# Altium schematic sheet preamp_gain_stage_2.SchDoc
size A4
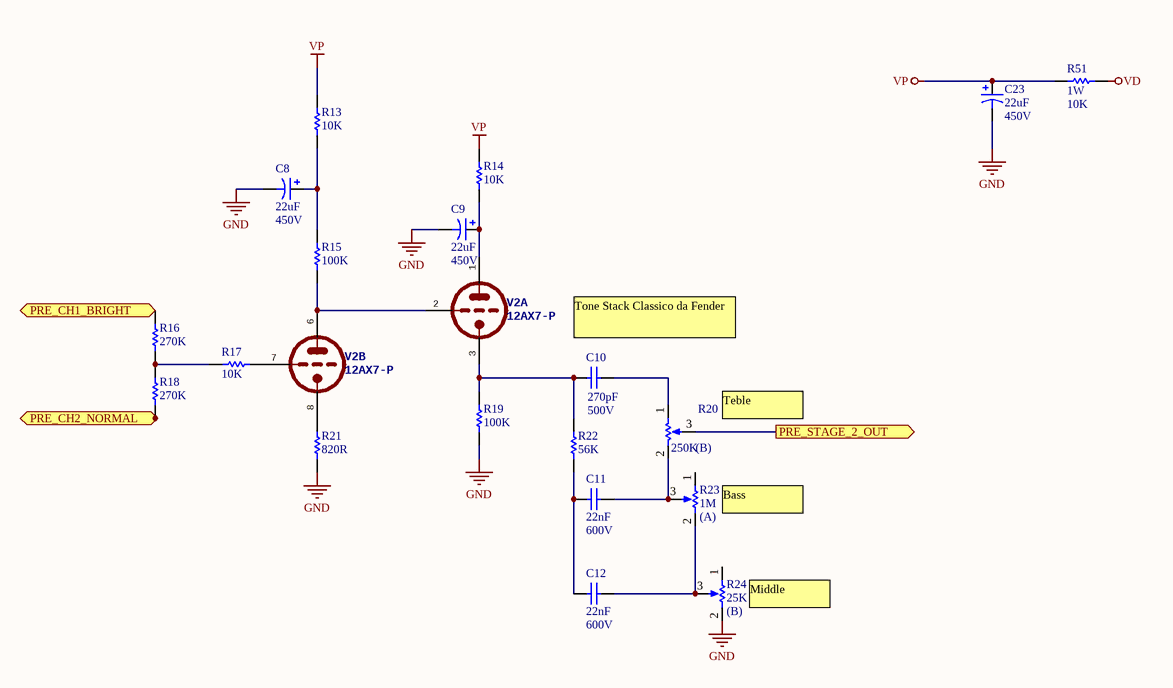
[diagram p0: preamp_gain_stage_2.SchDoc]

## Parts
C8  value 22uF  Voltage: 450V  [RAD-POL-7.6-15]  (hidden comment: Cap Pol Rad)
C9  value 22uF  Voltage: 450V  [RAD-POL-7.6-15]  (hidden comment: Cap Pol Rad)
C10  value 270pF  Voltage: 500V  [RAD-0.3]  (hidden comment: Cap)
C11  value 22nF  Voltage: 600V  [ORANGE-DROP-22nF-600V]  (hidden comment: Orange Drop Capacitor)
C12  value 22nF  Voltage: 600V  [ORANGE-DROP-22nF-600V]  (hidden comment: Orange Drop Capacitor)
C23  value 22uF  Voltage: 450V  [RAD-POL-7.6-15]  (hidden comment: Cap Pol Rad)
R13  value 10K  [AXIAL-0.6]  (hidden comment: Metal Film Resistor 1/2W)
R14  value 10K  [AXIAL-0.6]  (hidden comment: Metal Film Resistor 1/2W)
R15  value 100K  [AXIAL-0.6]  (hidden comment: Metal Film Resistor 1/2W)
R16  value 270K  [AXIAL-0.6]  (hidden comment: Metal Film Resistor 1/2W)
R17  value 10K  [AXIAL-0.6]  (hidden comment: Metal Film Resistor 1/2W)
R18  value 270K  [AXIAL-0.6]  (hidden comment: Metal Film Resistor 1/2W)
R19  value 100K  [AXIAL-0.6]  (hidden comment: Metal Film Resistor 1/2W)
R20  value 250K  TYPE: (B)  [pot_alpha - 2.54mm]  (hidden comment: ALPHA Potentiometer)
R21  value 820R  [AXIAL-0.6]  (hidden comment: Metal Film Resistor 1/2W)
R22  value 56K  [AXIAL-0.6]  (hidden comment: Metal Film Resistor 1/2W)
R23  value 1M  TYPE: (A)  [pot_alpha - 2.54mm]  (hidden comment: ALPHA Potentiometer)
R24  value 25K  TYPE: (B)  [pot_alpha - 2.54mm]  (hidden comment: ALPHA Potentiometer)
R51  value 10K  Power: 1W  [AXIAL-0.6]  (hidden comment: Metal Film Resistor 1W)
V2  12AX7-P  [NOVAL]  (parts A,B of 3)

## Ports
PRE_CH1_BRIGHT (in), PRE_CH2_NORMAL (in), PRE_STAGE_2_OUT (out)

## Nets
GND: C8.2 C9.2 C23.2 R19.2 R21.2 R24.2(BOT)
VD: R51.2
VP: C23.1 R13.1 R14.1 R51.1
PRE_CH1_BRIGHT: R16.1 ; port PRE_CH1_BRIGHT
PRE_STAGE_2_OUT: R20.3(TAP) ; port PRE_STAGE_2_OUT
NetC8_1: C8.1 R13.2 R15.1
NetC9_1: C9.1 R14.2 V2.1(TA)
NetC10_1: C10.1 R19.1 R22.1 V2.3(TK)
NetC10_2: C10.2 R20.1(TOP)
NetC11_1: C11.1 C12.1 R22.2
NetC11_2: C11.2 R20.2(BOT) R23.3(TAP)
NetC12_2: C12.2 R23.2(BOT) R24.3(TAP)
NetR15_2: R15.2 V2.2(TG) V2.6(TA)
NetR16_2: R16.2 R17.1 R18.1
NetR17_2: R17.2 V2.7(TG)
NetR21_1: R21.1 V2.8(TK)

Not connected (* = marked no-connect by the designer): R18 2; R23 1(TOP); R24 1(TOP)

## Notes on the sheet
- (near C10) Tone Stack Classico da Fender
- (near R20) Teble
- (near R23) Bass
- (near R24) Middle

## Library data of the parts
C8 C9 C23 = Cap Pol Rad: Polarized Capacitor (Axial); Published: 8-Jun-2000; LatestRevisionDate: 17-Jul-2002; LatestRevisionNote: Re-released for DXP Platform.; PackageReference: POLAR0.8; Publisher: Altium Limited; PackageDescription: Polarized Capacitor; 2 Leads
C10 = Cap: Capacitor; Published: 8-Jun-2000; LatestRevisionDate: 17-Jul-2002; LatestRevisionNote: Re-released for DXP Platform.; PackageReference: RAD-0.3; Publisher: Altium Limited; PackageDescription: Radial Cap, Thru-Hole; 2 Leads; 0.3 in Pin Spacing
C11 C12 = Cap-Orange-DROP-22nF-600V: Capacitor; ManufacturerPartNumber: 715P22356KD3; Published: 23-April-2014; LatestRevisionDate: 23-April-2014; LatestRevisionNote: Creating the document; PackageReference: Orange Drop; Publisher: Linda HB Amplifiers; PackageDescription: Radial Cap, Thru-Hole; 2 Leads; 9.75mm Pin Spacing
R13-R19 R21 R22 = Res Metal Film 1/2W: Semiconductor Resistor; Published: 8-Jun-2000; LatestRevisionDate: 17-Jul-2002; LatestRevisionNote: 12-Fev-2014; PackageReference: AXIAL-0.6; Publisher: Whitesheep Amps; PackageDescription: Axial Device, Thru-Hole; 2 Leads; 0.5 in Pin Spacing; Power: 1/2W
R20 R23 R24 = alpha-pot: Potentiometer; Sim Note: Enter the Resistance value and the set point into parameter fields.; Set Position: 0.5; Published: 8-Jun-2000; LatestRevisionDate: 17-Jul-2002; LatestRevisionNote: Re-released for DXP Platform.; PackageReference: VR5; Publisher: Altium Limited; PackageDescription: Variable Resistor, Thru-Hole; 3 Leads
R51 = Res Wire Wound 1W: Semiconductor Resistor; Published: 8-Jun-2000; LatestRevisionDate: 29-Mar-2014; LatestRevisionNote: 19-Mar-2014; PackageReference: AXIAL-0.5; Publisher: Linda Hand Buit Amplifiers; PackageDescription: Axial Device, Thru-Hole; 2 Leads; 0.5 in Pin Spacing